# EAGLE design PSPS_AVNC_SRD_CS_combined-2021-02-07 (EAGLE 9.6.2)
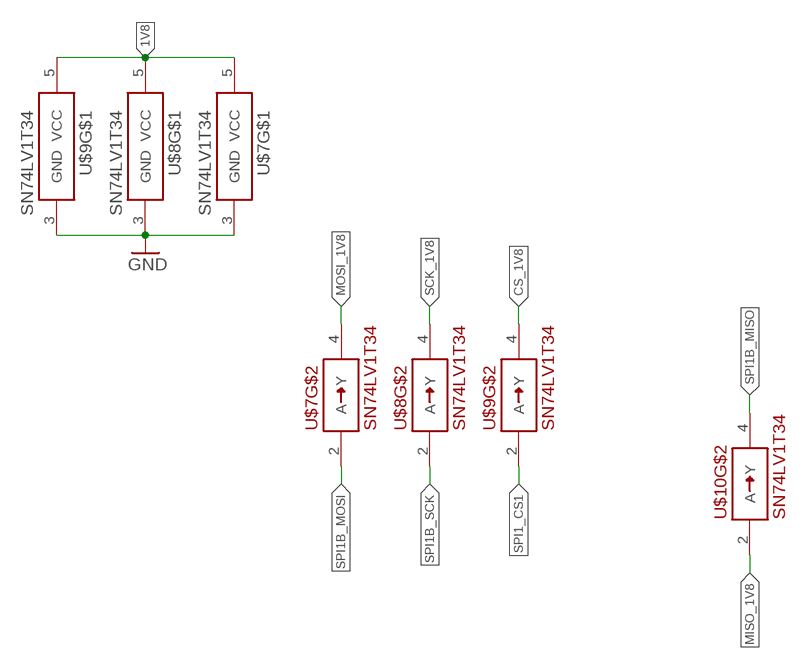
[diagram p0: schematic, sheet 1, part 1 of 2]
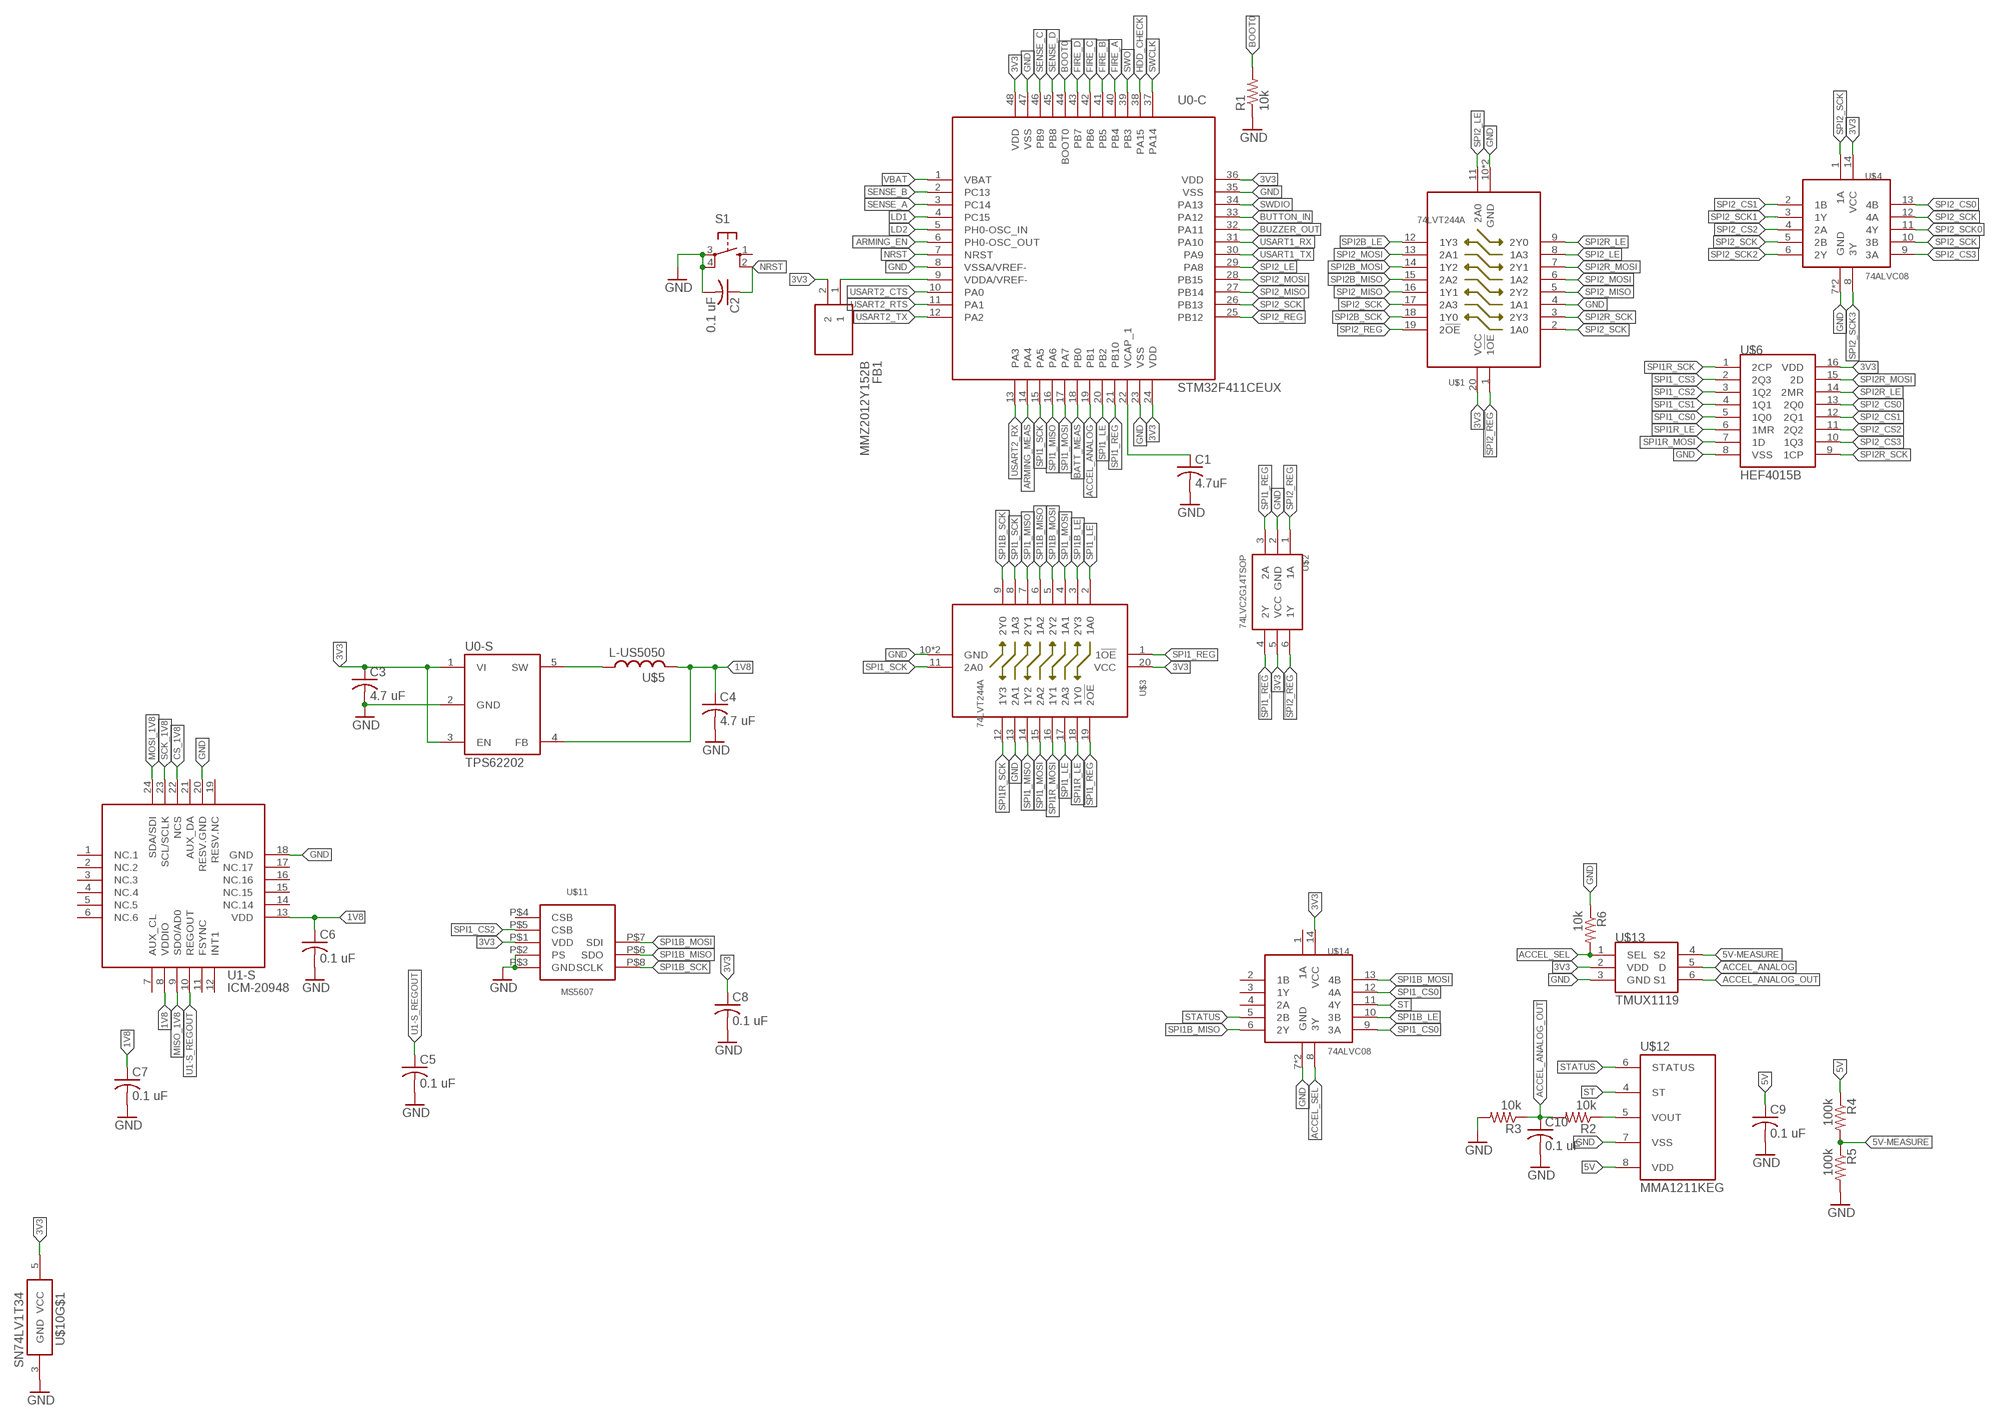
[diagram p1: schematic, sheet 1, part 2 of 2]

## Parts
C1  4.7uF  C-USC0805  [C0805]
C2  0.1 uF  C-USC0805  [C0805]
C3  4.7 uF  C-USC0805  [C0805]
C4  4.7 uF  C-USC0805  [C0805]
C5  0.1 uF  C-USC0805  [C0805]
C6  0.1 uF  C-USC0805  [C0805]
C7  0.1 uF  C-USC0805  [C0805]
C8  0.1 uF  C-USC0805  [C0805]
C9  0.1 uF  C-USC0805  [C0805]
C10  0.1 uF  C-USC0805  [C0805]
FB1  MMZ2012Y152B  [BEADC2012X105N]
R1  10k  R-US_M0805  [M0805]
R2  10k  R-US_M0805  [M0805]
R3  10k  R-US_M0805  [M0805]
R4  100k  R-US_M0805  [M0805]
R5  100k  R-US_M0805  [M0805]
R6  10k  R-US_M0805  [M0805]
S1  10-XX  [B3F-10XX]
U0-C  STM32F411CEUX  [QFN50P700X700X50-49T560N]
U0-S  TPS62202  [SOT95P280X145-5]
U1-S  ICM-20948  [QFN40P300X300X105-25T159X175]
U$1  74LVT244A  [QFN50P450X250X100-21T300X100N]
U$2  74LVC2G14TSOP  [SOP95P280X110-6N]
U$3  74LVT244A  [QFN50P450X250X100-21T300X100N]
U$4  74ALVC08  [QFN50P300X250X100-15T150X100N]
U$5  L-US5050  [INDDFN1250X1250X600-2N]
U$6  HEF4015B  [SOIC127P600X265-16N]
U$7  SN74LV1T34  [SOT65P210X110-5]
U$8  SN74LV1T34  [SOT65P210X110-5]
U$9  SN74LV1T34  [SOT65P210X110-5]
U$10  SN74LV1T34  [SOT65P210X110-5]
U$11  MS5607  [MS5607]
U$12  MMA1211KEG  [SOIC127P1041X355-16N]
U$13  TMUX1119  [SOP95P280X145-6N]
U$14  74ALVC08  [QFN50P300X250X100-15T150X100N]

## Nets
1V8: C4.1 C6.1 C7.1 U0-S.4(FB) U1-S.8(VDDIO) U1-S.13(VDD) U$5.2 U$7.5(VCC) U$8.5(VCC) U$9.5(VCC)
3V3: C3.1 C8.1 FB1.2 U0-C.24(VDD) U0-C.36(VDD) U0-C.48(VDD) U0-S.1(VI) U0-S.3(EN) U$1.20(VCC) U$2.5(VCC) U$3.20(VCC) U$4.14(VCC) U$6.16(VDD) U$10.5(VCC) U$11.P$1(VDD) U$13.2(VDD) U$14.14(VCC)
5V: C9.1 R4.1 U$12.8(VDD)
5V-MEASURE: R4.2 R5.1 U$13.4(S2)
!SPI1_REG!: U$2.4(2Y) U$3.19(2!OE!)
!SPI2_REG!: U$1.1(1!OE!) U$2.6(1Y)
ACCEL_ANALOG: U0-C.19(PB1) U$13.5(D)
ACCEL_ANALOG_OUT: C10.1 R2.2 R3.1 U$13.6(S1)
ACCEL_SEL: R6.2 U$13.1(SEL) U$14.8(3Y)
ARMING_EN: U0-C.6(PH0-OSC_OUT)
ARMING_MEAS: U0-C.14(PA4)
BATT_MEAS: U0-C.18(PB0)
BOOT0: R1.2 U0-C.44(BOOT0)
BUTTON_IN: U0-C.33(PA12)
BUZZER_OUT: U0-C.32(PA11)
CS_1V8: U1-S.22(NCS) U$9.4(Y)
FIRE_A: U0-C.40(PB4)
FIRE_B: U0-C.41(PB5)
FIRE_C: U0-C.42(PB6)
FIRE_D: U0-C.43(PB7)
GND: C1.2 C2.2 C3.2 C4.2 C5.2 C6.2 C7.2 C8.2 C9.2 C10.2 R1.1 R3.2 R5.2 R6.1 S1.3(P) S1.4(P1) U0-C.8(VSSA/VREF-) U0-C.23(VSS) U0-C.35(VSS) U0-C.47(VSS) U0-S.2(GND) U1-S.18(GND) U1-S.20(RESV.GND) U$1.4(1A1) U$1.10(GND) U$1.21(GND) U$2.2(GND) U$3.10(GND) U$3.13(2A1) U$3.21(GND) U$4.7(GND) U$4.15(GND) U$6.8(VSS) U$7.3(GND) U$8.3(GND) U$9.3(GND) U$10.3(GND) U$11.P$2(PS) U$11.P$3(GND) U$12.7(VSS) U$13.3(GND) U$14.7(GND) U$14.15(GND)
HDD_CHECK: U0-C.38(PA15)
LD1: U0-C.4(PC15)
LD2: U0-C.5(PH0-OSC_IN)
MISO_1V8: U1-S.9(SDO/AD0) U$10.2(A)
MOSI_1V8: U1-S.24(SDA/SDI) U$7.4(Y)
NRST: C2.1 S1.2(S1) U0-C.7(NRST)
SCK_1V8: U1-S.23(SCL/SCLK) U$8.4(Y)
SENSE_A: U0-C.3(PC14)
SENSE_B: U0-C.2(PC13)
SENSE_C: U0-C.46(PB9)
SENSE_D: U0-C.45(PB8)
SPI1_CS0: U$6.5(1Q0) U$14.9(3A) U$14.12(4A)
SPI1_CS1: U$6.4(1Q1) U$9.2(A)
SPI1_CS2: U$6.3(1Q2) U$11.P$5(CSB)
SPI1_CS3: U$6.2(2Q3)
SPI1_LE: U0-C.20(PB2) U$3.2(1A0) U$3.17(2A3)
SPI1_MISO: U0-C.16(PA6) U$3.7(2Y1) U$3.14(1Y2)
SPI1_MOSI: U0-C.17(PA7) U$3.4(1A1) U$3.15(2A2)
SPI1_REG: U0-C.21(PB10) U$2.3(2A) U$3.1(1!OE!)
SPI1_SCK: U0-C.15(PA5) U$3.8(1A3) U$3.11(2A0)
SPI1B_LE: U$3.3(2Y3) U$14.10(3B)
SPI1B_MISO: U$3.6(1A2) U$10.4(Y) U$11.P$6(SDO) U$14.6(2Y)
SPI1B_MOSI: U$3.5(2Y2) U$7.2(A) U$11.P$7(SDI) U$14.13(4B)
SPI1B_SCK: U$3.9(2Y0) U$8.2(A) U$11.P$8(SCLK)
SPI1R_LE: U$3.18(1Y0) U$6.6(1MR)
SPI1R_MOSI: U$3.16(1Y1) U$6.7(1D)
SPI1R_SCK: U$3.12(1Y3) U$6.1(2CP)
SPI2_CS0: U$4.13(4B) U$6.13(2Q0)
SPI2_CS1: U$4.2(1B) U$6.12(2Q1)
SPI2_CS2: U$4.4(2A) U$6.11(2Q2)
SPI2_CS3: U$4.9(3A) U$6.10(1Q3)
SPI2_LE: U0-C.29(PA8) U$1.8(1A3) U$1.11(2A0)
SPI2_MISO: U0-C.27(PB14) U$1.5(2Y2) U$1.16(1Y1)
SPI2_MOSI: U0-C.28(PB15) U$1.6(1A2) U$1.13(2A1)
SPI2_REG: U0-C.25(PB12) U$1.19(2!OE!) U$2.1(1A)
SPI2_SCK: U0-C.26(PB13) U$1.2(1A0) U$1.17(2A3) U$4.1(1A) U$4.5(2B) U$4.10(3B) U$4.12(4A)
SPI2_SCK0: U$4.11(4Y)
SPI2_SCK1: U$4.3(1Y)
SPI2_SCK2: U$4.6(2Y)
SPI2_SCK3: U$4.8(3Y)
SPI2B_LE: U$1.12(1Y3)
SPI2B_MISO: U$1.15(2A2)
SPI2B_MOSI: U$1.14(1Y2)
SPI2B_SCK: U$1.18(1Y0)
SPI2R_LE: U$1.9(2Y0) U$6.14(2MR)
SPI2R_MOSI: U$1.7(2Y1) U$6.15(2D)
SPI2R_SCK: U$1.3(2Y3) U$6.9(1CP)
ST: U$12.4(ST) U$14.11(4Y)
STATUS: U$12.6(STATUS) U$14.5(2B)
SWCLK: U0-C.37(PA14)
SWDIO: U0-C.34(PA13)
SWO: U0-C.39(PB3)
U0-S_SW: U0-S.5(SW) U$5.1
U0-S_VOUT: R2.1 U$12.5(VOUT)
U1-S_REGOUT: C5.1 U1-S.10(REGOUT)
USART1_RX: U0-C.31(PA10)
USART1_TX: U0-C.30(PA9)
USART2_CTS: U0-C.10(PA0)
USART2_RTS: U0-C.11(PA1)
USART2_RX: U0-C.13(PA3)
USART2_TX: U0-C.12(PA2)
VBAT: U0-C.1(VBAT)
VCAP_1: C1.1 U0-C.22(VCAP_1)
VDDA: FB1.1 U0-C.9(VDDA/VREF-)
Unconnected: S1.1(S) U1-S.1(NC.1) U1-S.2(NC.2) U1-S.3(NC.3) U1-S.4(NC.4) U1-S.5(NC.5) U1-S.6(NC.6) U1-S.7(AUX_CL) U1-S.11(FSYNC) U1-S.12(INT1) U1-S.14(NC.14) U1-S.15(NC.15) U1-S.16(NC.16) U1-S.17(NC.17) U1-S.19(RESV.NC) U1-S.21(AUX_DA) U$11.P$4(CSB) U$14.1(1A) U$14.2(1B) U$14.3(1Y) U$14.4(2A)

## Library data of the parts
C1-C10 = resistor:C-US: CAPACITOR, American symbol
FB1 = Computer2:MMZ2012Y152B: Ferrite bead SMD 1500Ohm 500mA TDK Ferrite Bead (Chip Bead), 2 x 1.25 x 0.85mm (0805) Source: Datasheet <https://componentsearchengine.com/Datasheets/1/MMZ2012Y152B.pdf>; DESCRIPTION: Ferrite bead SMD 1500Ohm 500mA TDK Ferrite Bead (Chip Bead), 2 x 1.25 x 0.85mm (0805); HEIGHT: 1.05mm; MANUFACTURER_NAME: TDK; MANUFACTURER_PART_NUMBER: MMZ2012Y152B; MOUSER_PART_NUMBER: 810-MMZ2012Y152B; MOUSER_PRICE-STOCK: https://www.mouser.com/Search/Refine.aspx?Keyword=810-MMZ2012Y152B
R1-R6 = resistor:R-US_: RESISTOR, American symbol
S1 = switch-omron:10-XX: OMRON SWITCH; MPN: B3F-1000; OC_FARNELL: 176432; OC_NEWARK: 36M3542
U0-C = Computer2:STM32F411CEUX: STM32F411CEUx https://www.mouser.com/ProductDetail/STMicroelectronics/STM32F411CEU7/?qs=k5OWtXsTJaprF2FuhgNRlw%3D%3D
U0-S = Computer2:TPS62202: 1.8-V Output, 300-mA, 95% Efficient Step-Down Converter in SOT-23 http://www.ti.com/product/TPS62202
U1-S = Computer2:ICM-20948: 9 Axis Motion Sensor from TDK InvenSense https://store.invensense.com/products/detail/ICM20948-InvenSense/597203/
U$1 U$3 = Computer2:74LVT244A: 3.3 V octal buffer/line driver; 3-state (split) https://www.mouser.com/ProductDetail/Nexperia/74LVT244ABQ115/?qs=me8TqzrmIYX0op6H%252BBs37A%3D%3D
U$2 = Computer2:74LVC2G14: Dual inverting Schmitt trigger with 5 V tolerant input https://www.mouser.com/ProductDetail/Nexperia/74LVC2G14GF132/?qs=me8TqzrmIYXgua1MCaM%2FQg%3D%3D
U$4 U$14 = Computer2:74ALVC08: Quad 2-input AND Gate
U$5 = Computer2:L-US
U$6 = Computer2:HEF4015B
U$7-U$10 = Computer2:SN74LV1T34: Single Power Supply BUFFER Logic Level Shifter
U$11 = Computer2:MS5607
U$12 = Computer2:MMA1211KEG
U$13 = Computer2:TMUX1119: Analog Switch IC (Multiplexer) https://www.mouser.com/ProductDetail/Texas-Instruments/TMUX1119DBVR/?qs=9r4v7xj2Lnn%2FqYCDWCSZ7w%3D%3D

## Board
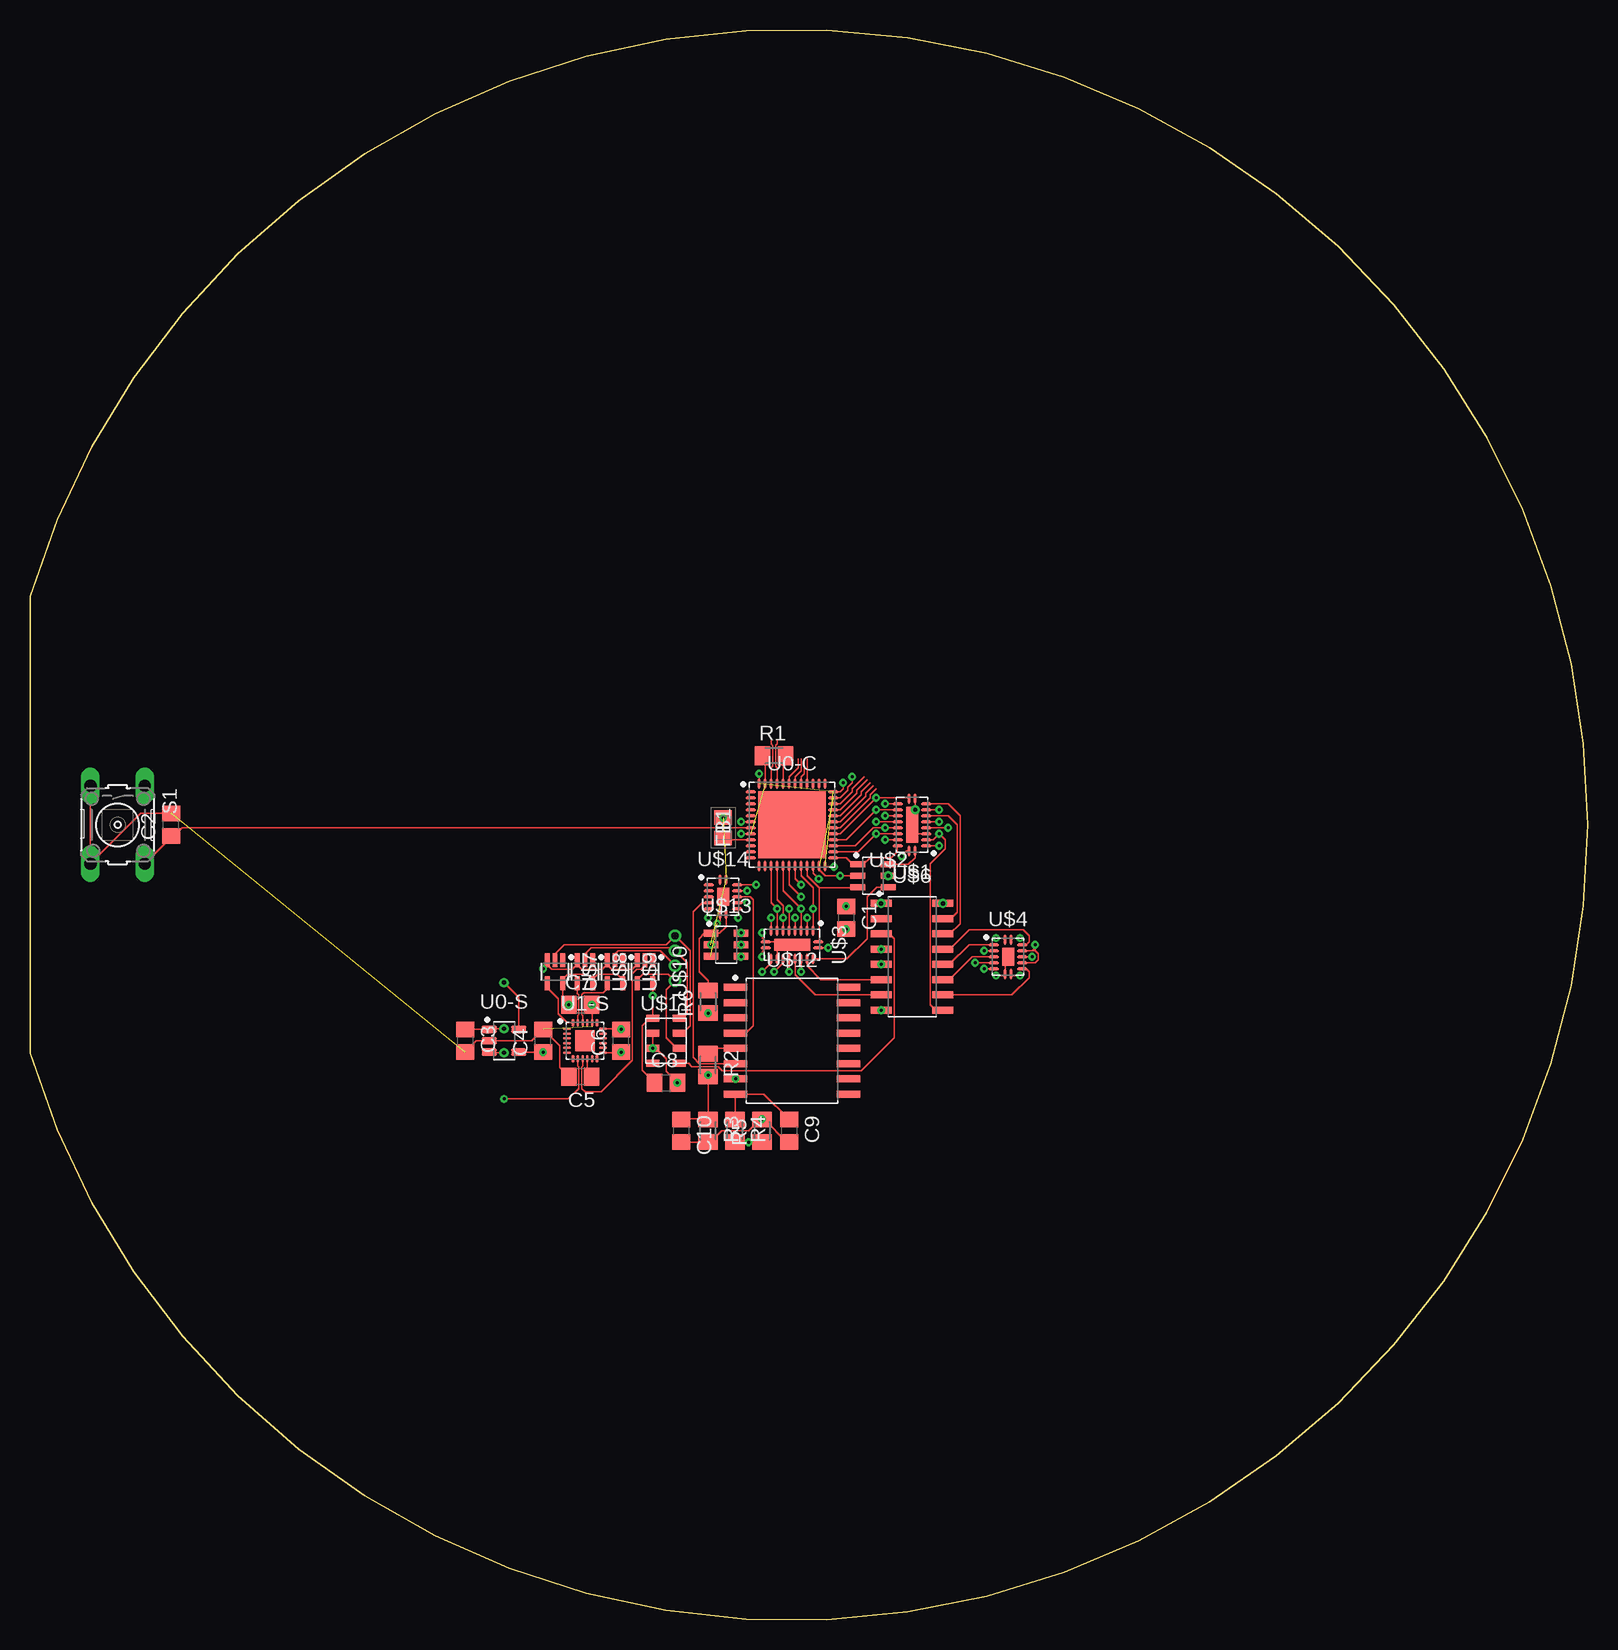
[diagram p2: board, top side]
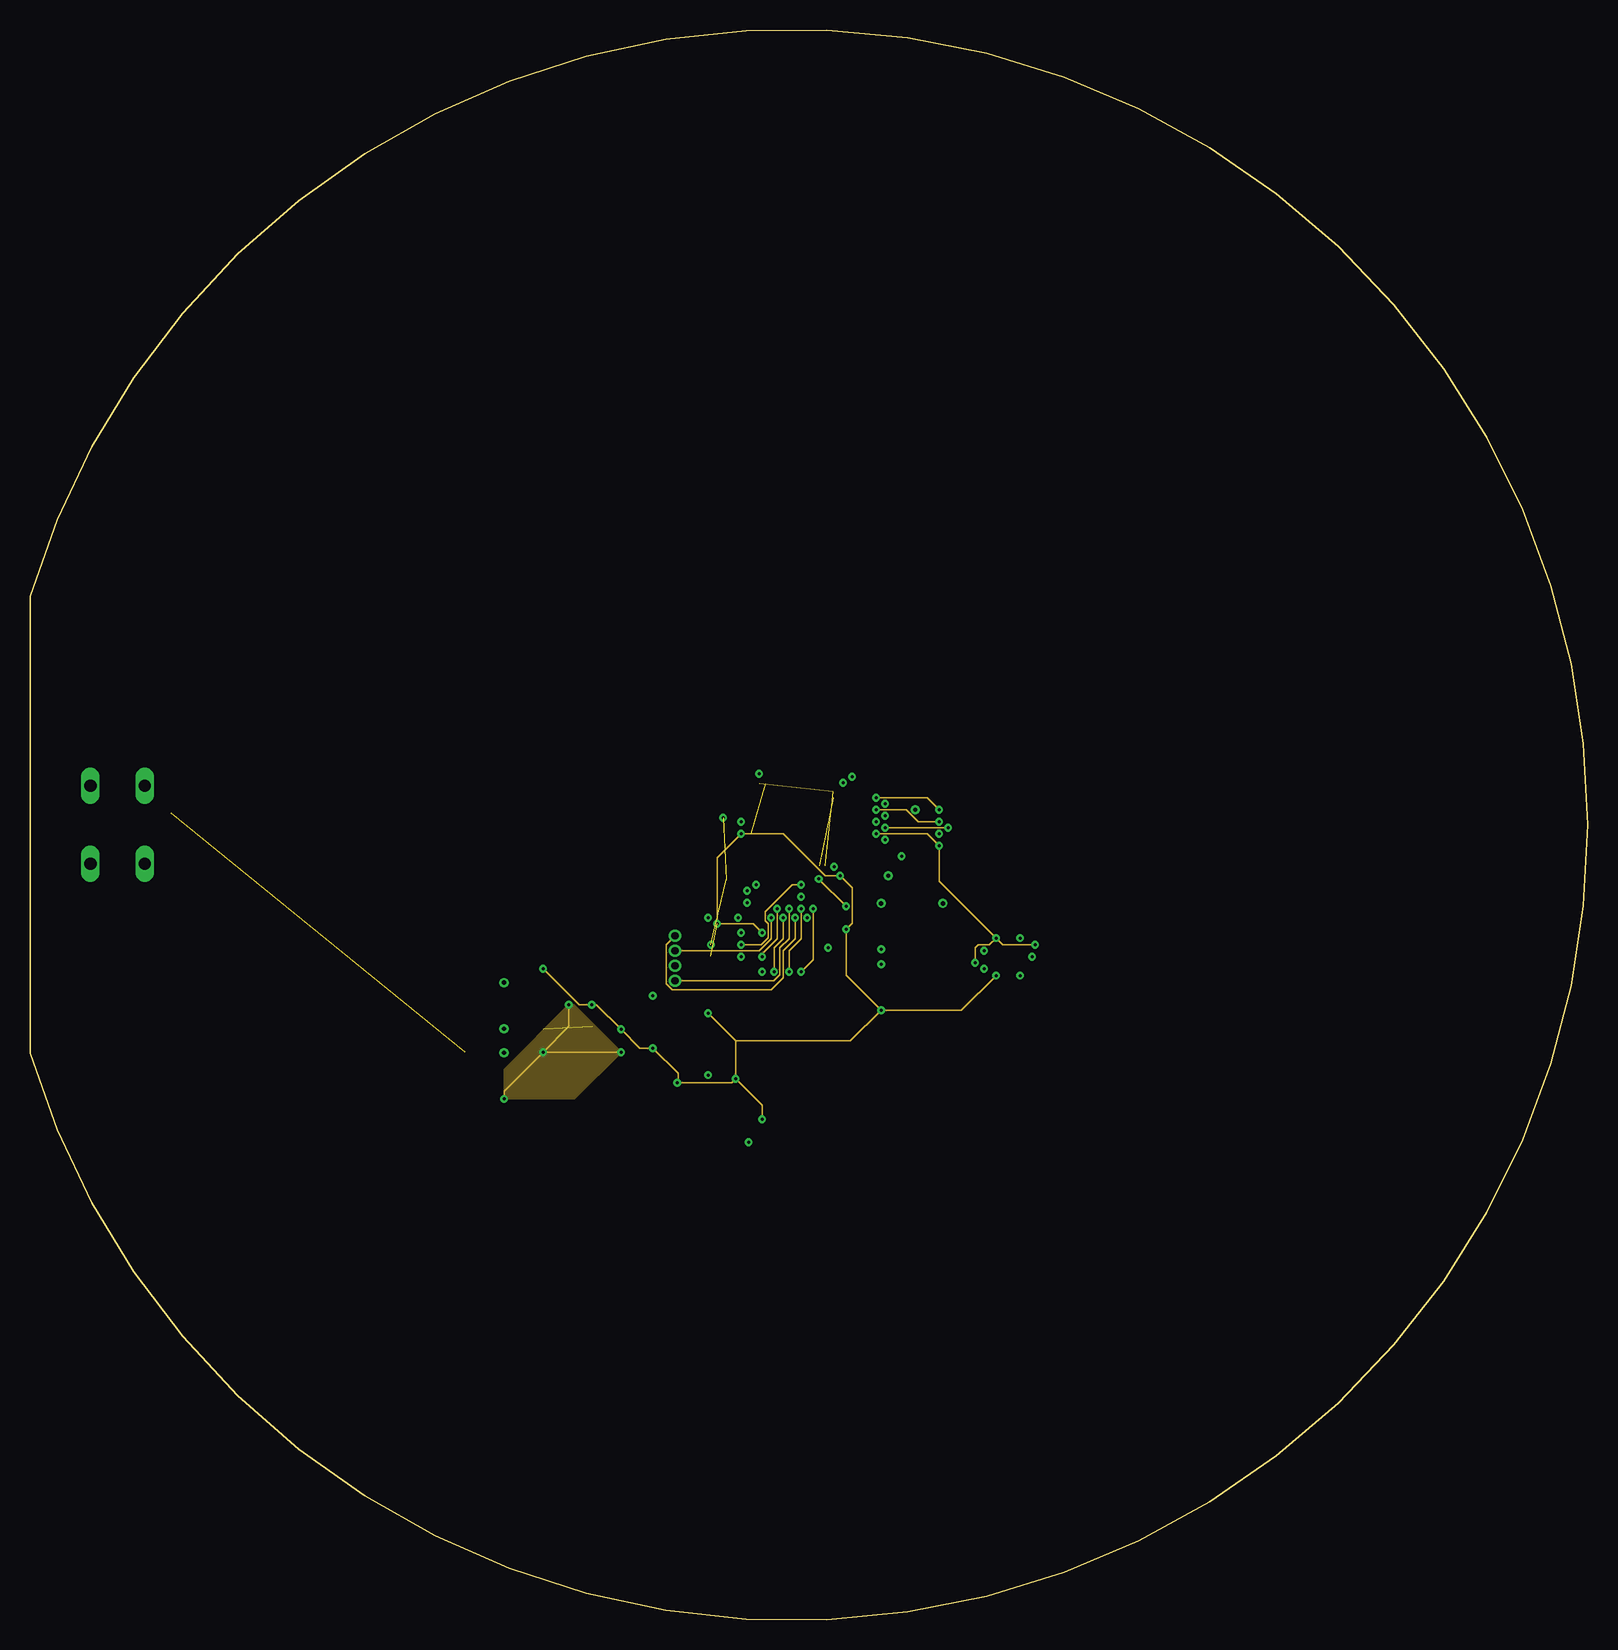
[diagram p3: board, inner layer Route2]
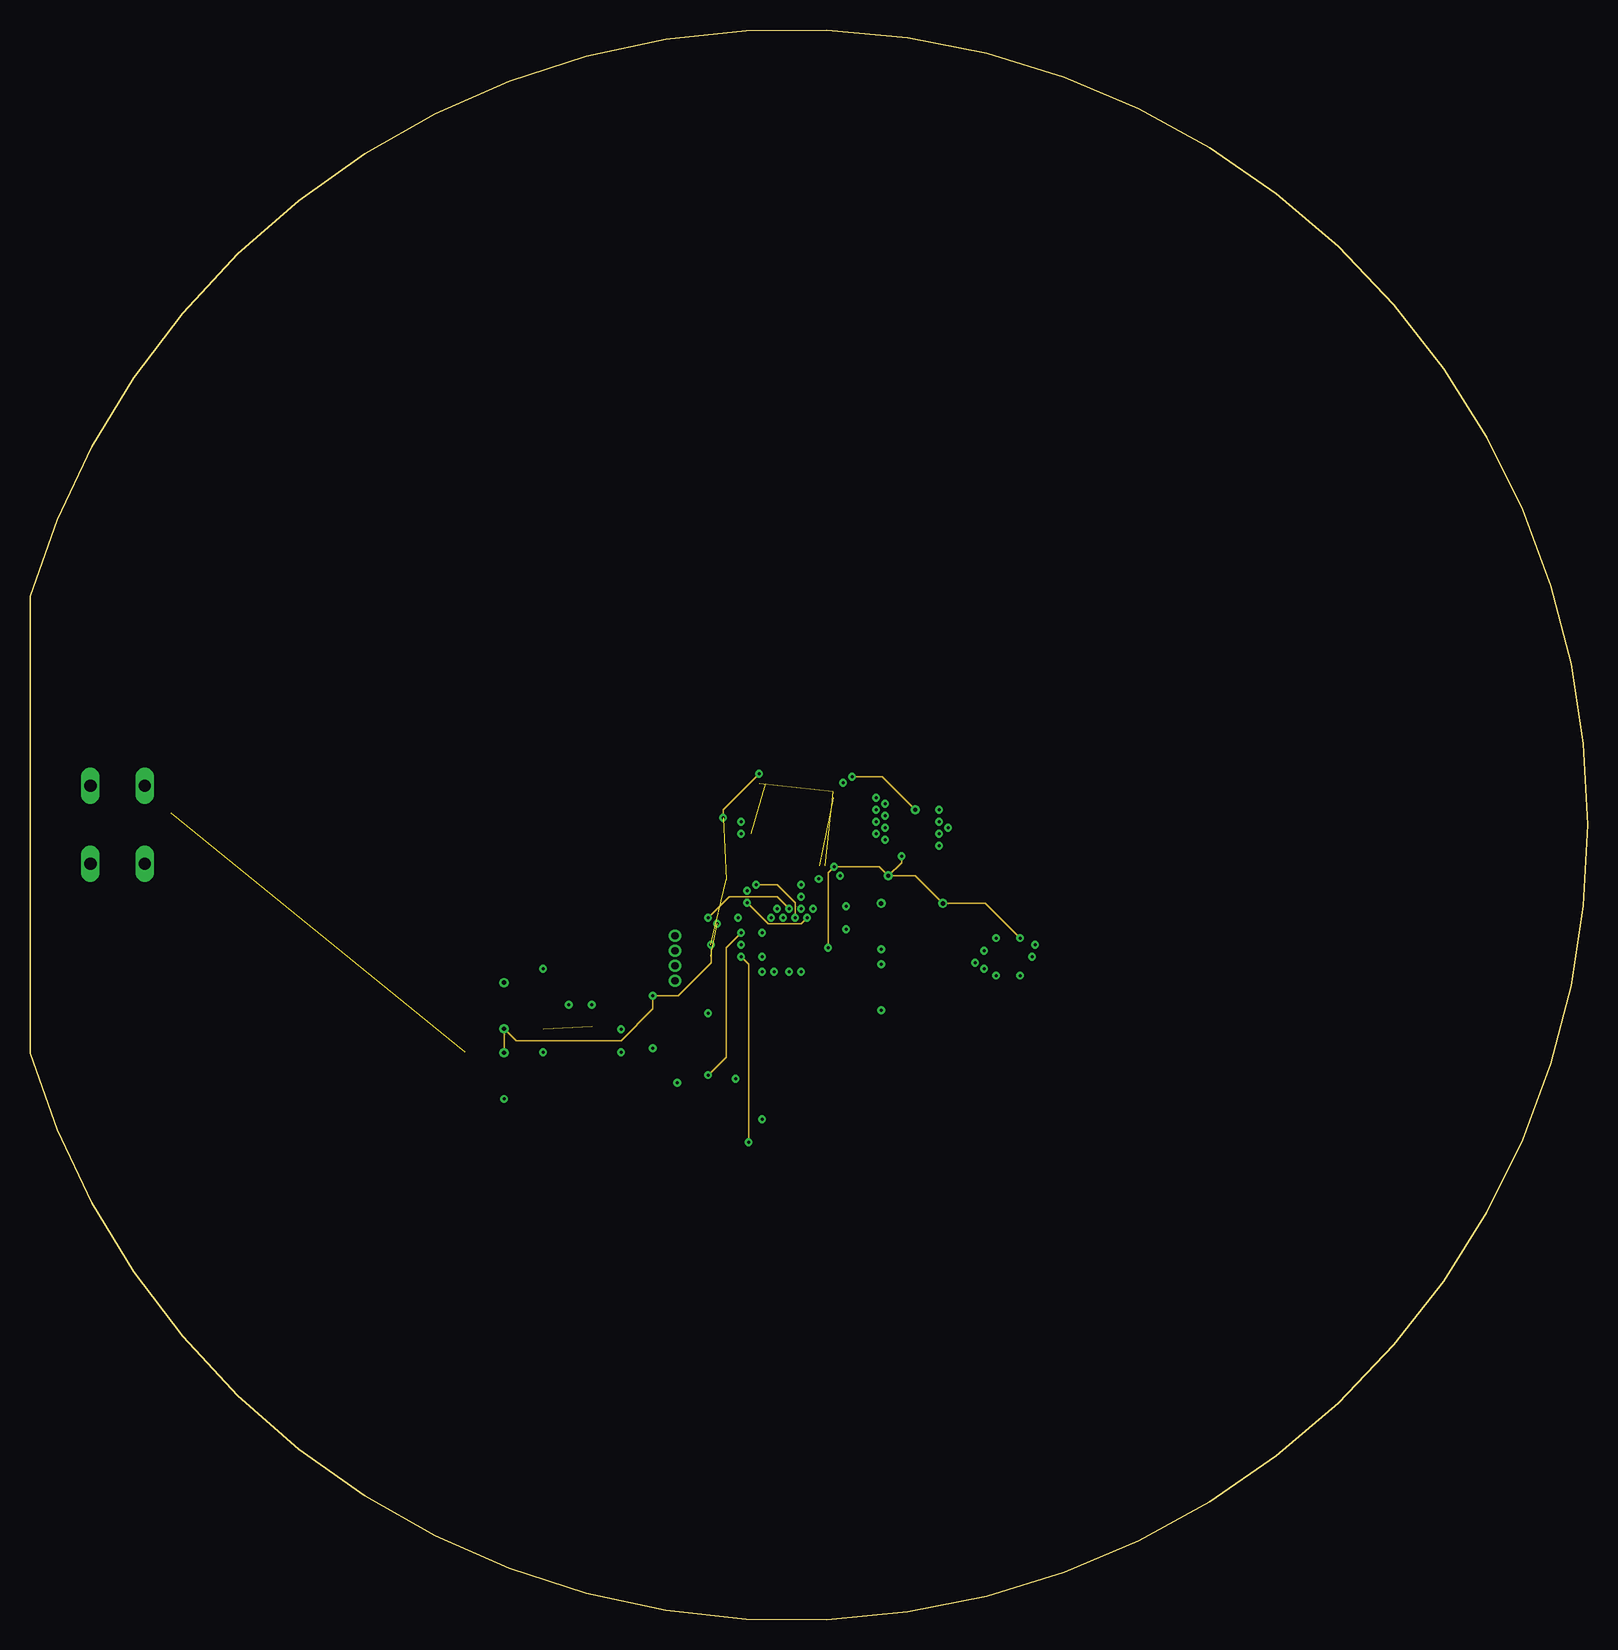
[diagram p4: board, inner layer Route15]
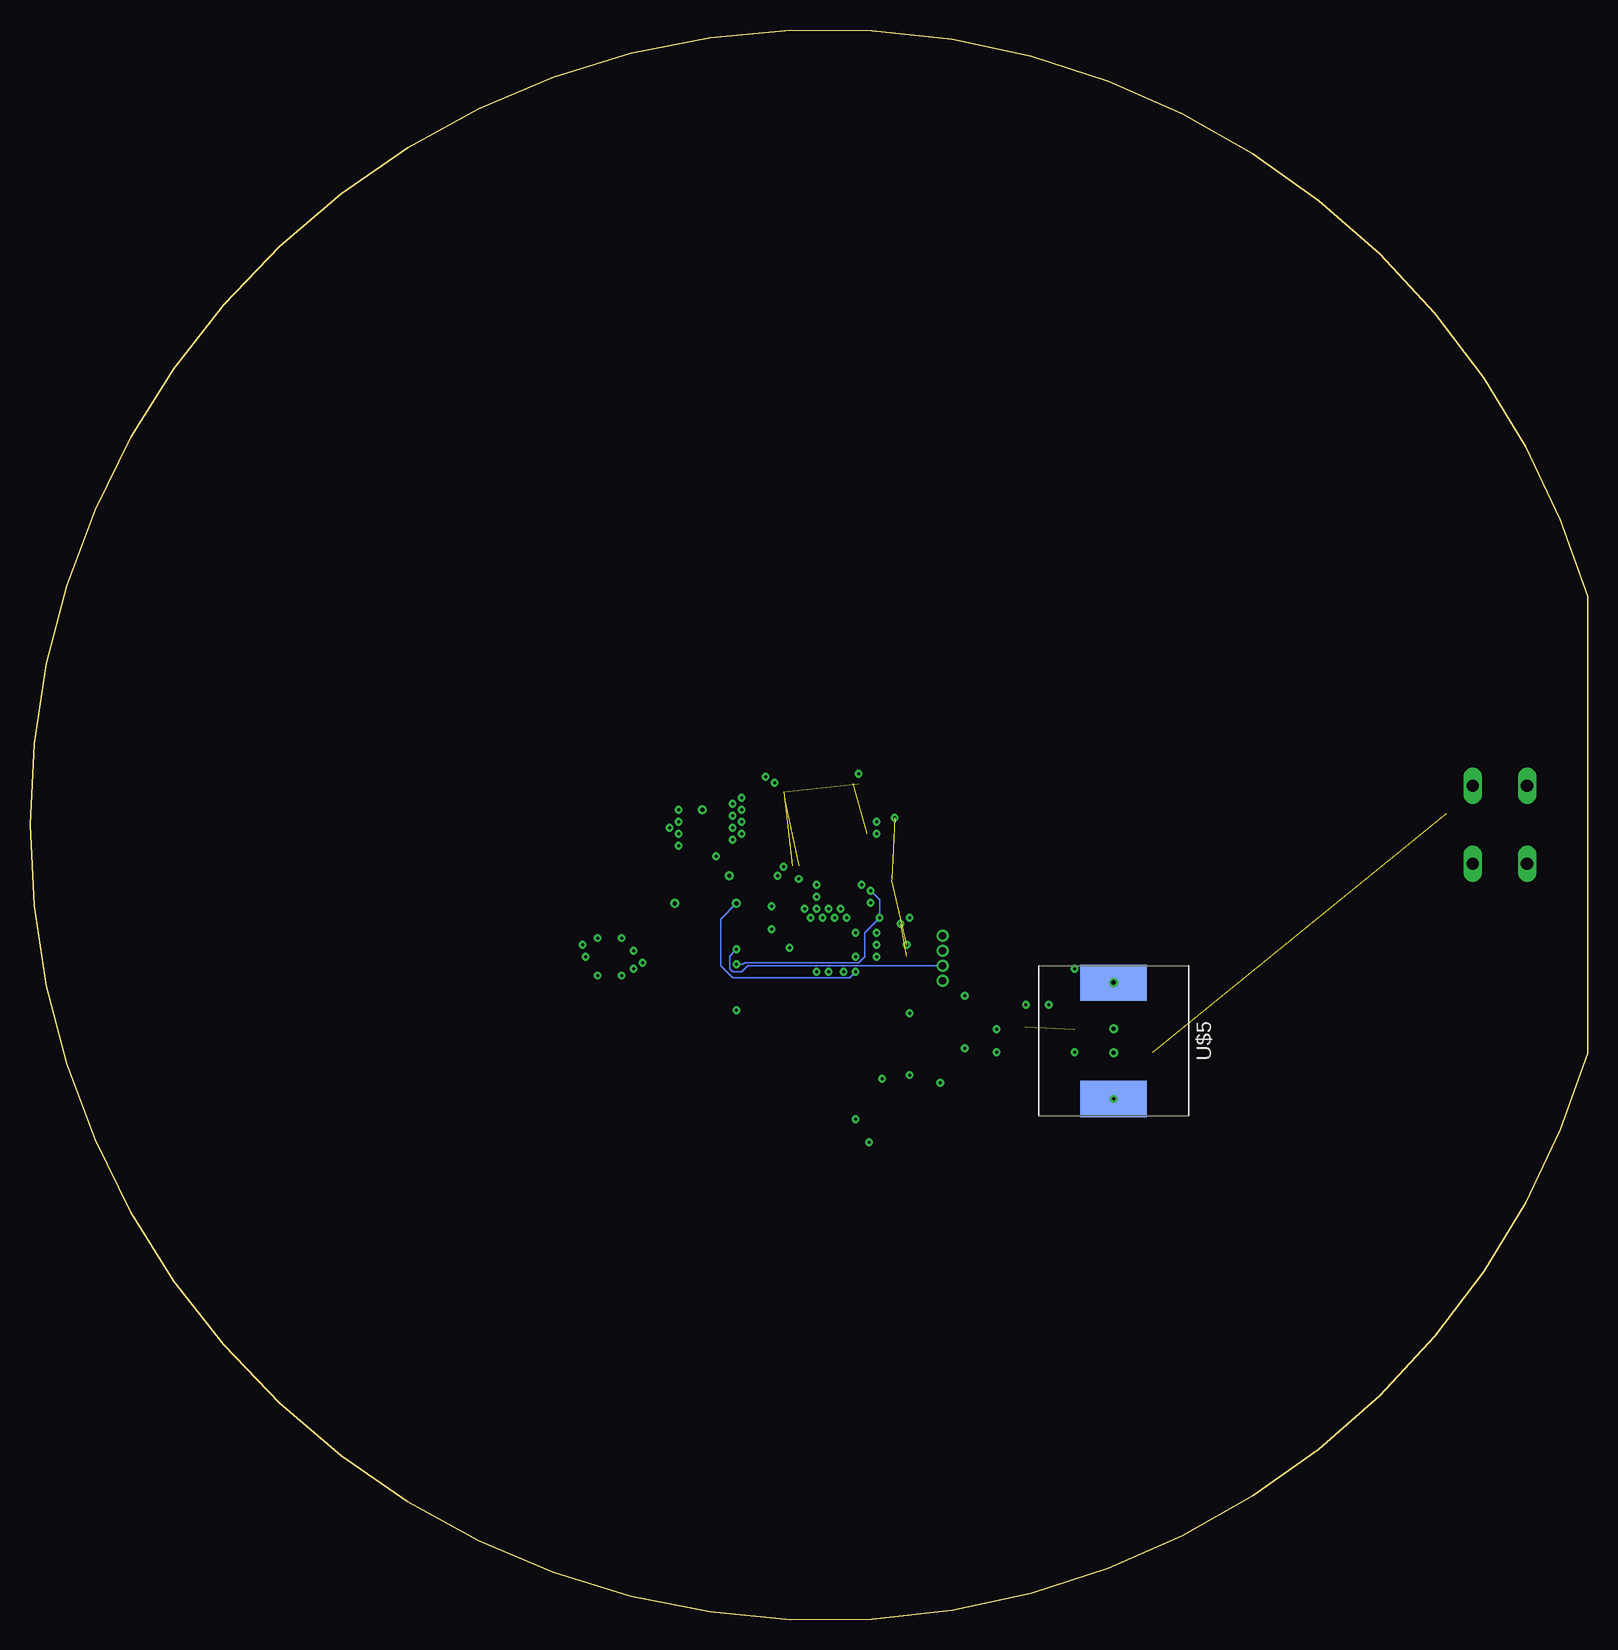
[diagram p5: board, bottom side, seen from below]

Size 129.8 x 132.46 mm. Coordinates in mm from the lower left corner, seen from the top.
Outline: 0,47.18 0,85.28 arc-327 0,47.18
Copper layers (1+2*15+16): Top 0.035mm / dielectric 1.5mm / Route2 0.035mm / dielectric 0.15mm / Route15 0.035mm / dielectric 0.2mm / Bottom 0.035mm
Design rules "default *": minimum track width 4mil, minimum drill 0.25mm, track to track 4mil, track to pad 4mil, pad to pad 4mil, via to via 4mil, smd to smd 4mil, copper to edge 20mil, drill to drill 4mil, minimum pad ring 10mil, minimum via ring 8mil, stop-mask expansion 4mil, vias tented up to drill 0mil, thermal gap 10mil

### Footprints (pad centres in the part's own frame; a part is rotated, then mirrored left to right if it is on the bottom)
C0805 = smd 1.3 x 1.5: 1 -0.95,0; 2 0.95,0
BEADC2012X105N = smd 1.2 x 1.45: 1 -0.85,0; 2 0.85,0
M0805 = smd 1.3 x 1.6: 1 -0.95,0; 2 0.95,0
B3F-10XX = drill 1.016 long: 1 -3.251,2.261; 2 3.251,2.261; 3 -3.251,-2.261; 4 3.251,-2.261
QFN50P700X700X50-49T560N = smd 0.86 x 0.27: 1 -3.435,2.75; 2 -3.435,2.25; 3 -3.435,1.75; 4 -3.435,1.25; 5 -3.435,0.75; 6 -3.435,0.25; 7 -3.435,-0.25; 8 -3.435,-0.75; 9 -3.435,-1.25; 10 -3.435,-1.75; 11 -3.435,-2.25; 12 -3.435,-2.75; 25 3.435,-2.75; 26 3.435,-2.25; 27 3.435,-1.75; 28 3.435,-1.25; 29 3.435,-0.75; 30 3.435,-0.25; 31 3.435,0.25; 32 3.435,0.75; 33 3.435,1.25; 34 3.435,1.75; 35 3.435,2.25; 36 3.435,2.75 | smd 0.27 x 0.86: 13 -2.75,-3.435; 14 -2.25,-3.435; 15 -1.75,-3.435; 16 -1.25,-3.435; 17 -0.75,-3.435; 18 -0.25,-3.435; 19 0.25,-3.435; 20 0.75,-3.435; 21 1.25,-3.435; 22 1.75,-3.435; 23 2.25,-3.435; 24 2.75,-3.435; 37 2.75,3.435; 38 2.25,3.435; 39 1.75,3.435; 40 1.25,3.435; 41 0.75,3.435; 42 0.25,3.435; 43 -0.25,3.435; 44 -0.75,3.435; 45 -1.25,3.435; 46 -1.75,3.435; 47 -2.25,3.435; 48 -2.75,3.435 | smd 5.6 x 5.6: 49 0,0
SOT95P280X145-5 = smd 1.259 x 0.609: 1 -1.228,0.95; 2 -1.228,0; 3 -1.228,-0.95; 4 1.228,-0.95; 5 1.228,0.95
QFN40P300X300X105-25T159X175 = smd 0.635 x 0.203: 1 -1.496,1; 2 -1.496,0.6; 3 -1.496,0.2; 4 -1.496,-0.2; 5 -1.496,-0.6; 6 -1.496,-1; 13 1.496,-1; 14 1.496,-0.6; 15 1.496,-0.2; 16 1.496,0.2; 17 1.496,0.6; 18 1.496,1 | smd 0.203 x 0.635: 7 -1,-1.496; 8 -0.6,-1.496; 9 -0.2,-1.496; 10 0.2,-1.496; 11 0.6,-1.496; 12 1,-1.496; 19 1,1.496; 20 0.6,1.496; 21 0.2,1.496; 22 -0.2,1.496; 23 -0.6,1.496; 24 -1,1.496 | smd 1.59 x 1.75: 25 0,0
QFN50P450X250X100-21T300X100N = smd 0.27 x 0.86: 1 -0.25,2.185; 10 -0.25,-2.185; 11 0.25,-2.185; 20 0.25,2.185 | smd 0.86 x 0.27: 2 -1.185,1.75; 3 -1.185,1.25; 4 -1.185,0.75; 5 -1.185,0.25; 6 -1.185,-0.25; 7 -1.185,-0.75; 8 -1.185,-1.25; 9 -1.185,-1.75; 12 1.185,-1.75; 13 1.185,-1.25; 14 1.185,-0.75; 15 1.185,-0.25; 16 1.185,0.25; 17 1.185,0.75; 18 1.185,1.25; 19 1.185,1.75 | smd 1 x 3: 21 0,0
SOP95P280X110-6N = smd 1.265 x 0.497: 1 -1.273,0.95; 2 -1.273,0; 3 -1.273,-0.95; 4 1.273,-0.95; 5 1.273,0; 6 1.273,0.95
QFN50P300X250X100-15T150X100N = smd 0.27 x 0.86: 1 -0.25,1.435; 7 -0.25,-1.435; 8 0.25,-1.435; 14 0.25,1.435 | smd 0.86 x 0.27: 2 -1.185,1; 3 -1.185,0.5; 4 -1.185,0; 5 -1.185,-0.5; 6 -1.185,-1; 9 1.185,-1; 10 1.185,-0.5; 11 1.185,0; 12 1.185,0.5; 13 1.185,1 | smd 1 x 1.5: 15 0,0
INDDFN1250X1250X600-2N = smd 3.012 x 5.512: 1 -4.85,0; 2 4.85,0
SOIC127P600X265-16N = smd 1.765 x 0.592: 1 -2.575,4.445; 2 -2.575,3.175; 3 -2.575,1.905; 4 -2.575,0.635; 5 -2.575,-0.635; 6 -2.575,-1.905; 7 -2.575,-3.175; 8 -2.575,-4.445; 9 2.575,-4.445; 10 2.575,-3.175; 11 2.575,-1.905; 12 2.575,-0.635; 13 2.575,0.635; 14 2.575,1.905; 15 2.575,3.175; 16 2.575,4.445
SOT65P210X110-5 = smd 1.186 x 0.397: 1 -0.962,0.65; 2 -0.962,0; 3 -0.962,-0.65; 4 0.962,-0.65; 5 0.962,0.65
MS5607 = smd 1.1 x 0.6: P$1 -1.1,1.875; P$2 -1.1,0.625; P$3 -1.1,-0.625; P$4 -1.1,-1.875; P$5 1.1,-1.875; P$6 1.1,-0.625; P$7 1.1,0.625; P$8 1.1,1.875
SOIC127P1041X355-16N = smd 1.973 x 0.589: 1 -4.705,4.445; 2 -4.705,3.175; 3 -4.705,1.905; 4 -4.705,0.635; 5 -4.705,-0.635; 6 -4.705,-1.905; 7 -4.705,-3.175; 8 -4.705,-4.445; 9 4.705,-4.445; 10 4.705,-3.175; 11 4.705,-1.905; 12 4.705,-0.635; 13 4.705,0.635; 14 4.705,1.905; 15 4.705,3.175; 16 4.705,4.445
SOP95P280X145-6N = smd 1.209 x 0.584: 1 -1.253,0.95; 2 -1.253,0; 3 -1.253,-0.95; 4 1.253,-0.95; 5 1.253,0; 6 1.253,0.95

### Placement (x,y rotation side)
C1  68,58.48 270 top
C2  11.75,66.23 90 top
C3  36.25,48.23 270 top
C4  42.75,48.23 90 top
C5  45.85,45.23 180 top
C6  49.25,48.23 90 top
C7  45.85,51.23 0 top
C8  53,44.73 0 top
C9  63.25,40.73 270 top
C10  54.25,40.73 270 top
FB1  57.75,65.98 90 top
R1  62,71.98 0 top
R2  56.5,46.2 270 top
R3  56.5,40.73 270 top
R4  58.75,40.73 270 top
R5  61,40.73 90 top
R6  56.5,51.48 90 top
S1  7.3,66.23 270 top
U0-C  63.5,66.23 0 top
U0-S  39.5,48.23 0 top
U1-S  46.25,48.23 0 top
U$1  73.5,66.23 180 top
U$2  70.25,61.98 0 top
U$3  63.5,56.23 270 top
U$4  81.5,55.23 0 top
U$5  39.5,48.23 270 bottom
U$6  73.5,55.23 0 top
U$7  43.75,53.98 270 top
U$8  46.25,53.98 270 top
U$9  48.75,53.98 270 top
U$10  51.25,53.98 270 top
U$11  53,48.23 0 top
U$12  63.5,48.23 0 top
U$13  58,56.23 0 top
U$14  57.75,60.23 0 top

### Tracks (layer width: path | path; a pad name or v marks a point on that pad's centre or on a via)
1V8  (via drill 0.25)
  Top 0.127: U0-S.4 C4.1 | U1-S.8 45.65,46.11 45.72,46.05 45.72,44.25 44.85,43.38 U$5.2 | C6.1 49.2,47.23 U1-S.13 | U$9.5 49.4,53.33 48.95,53.78 47.3,53.78 46.9,53.38 U$8.5 46.9,53.33 46.45,53.78 44.8,53.78 44.4,53.38 U$7.5 44.4,51.73 C7.1
  Route2 0.127: C4.1 C6.1 | C7.1 44.9,49.43 C4.1 | U$5.2 39.5,44.03 C4.1
  other vias: 44.9,51.23 44.9,51.23 42.75,47.28 39.5,43.38 49.25,47.28
  pour Route2 (no thermals): 39.5,43.38 39.5,45.83 44.9,51.23 45.3,51.23 49.25,47.28 45.35,43.38
3V3  (via drill 0.25, 0.35)  (4 unrouted)
  Top 0.127: U0-C.24 66.31,62.73 v67,62.73 | U$1.20 73.06,64.05 v72.62,63.61 | U$3.20 v66.5,55.98 | U0-C.36 67.5,68.98 67.75,69.23 v67.75,69.73 | C3.1 U0-S.1 38.32,49.23 v39.5,49.23 | U0-S.3 38.32,47.23 v39.5,47.23 | U$4.14 81.88,56.8 v82.5,56.8 | U$10.5 v51.9,51.98 U$11.P$1 51.62,50.11 51,49.48 51,45.78 C8.1 | U0-C.48 v60.75,70.48
  Route15 0.127: U$2.5 70.77,62.73 v67,62.73 66.5,62.23 v66.5,55.98 | U$2.5 72.62,63.08 v72.62,63.61 | U$2.5 73.77,61.98 U$6.16 79.62,59.68 v82.5,56.8 | v39.5,47.23 v39.5,49.23 40.5,48.23 49.25,48.23 51.9,50.88 v51.9,51.98 54,51.98 56.75,54.73 U$13.2 | FB1.2 57.75,67.48 v60.75,70.48
  other vias: 71.52,61.98 76.08,59.68 57.75,66.83 56.75,56.23
5V
  Top 0.127: R4.1 58.75,43.74 U$12.8 61.15,43.79 C9.1
5V-MEASURE  (via drill 0.25)
  Top 0.127: R5.1 v59.88,39.78 R4.2 | U$13.4 v59.25,55.24
  Route15 0.127: v59.25,55.24 59.88,54.62 v59.88,39.78
!SPI1_REG!
  Top 0.127: U$3.19 66.25,55.05 66.31,55.05 68.06,55.05 69.75,56.73 69.75,60.23 70.55,61.03 U$2.4
!SPI2_REG!
  Top 0.127: U$1.1 73.75,63.48 73.2,62.93 U$2.6
ACCEL_ANALOG  (via drill 0.25)
  Top 0.127: U0-C.19 63.75,61.73 v64.25,61.23
  Route2 0.127: v64.25,61.23 63.5,61.23 61.25,58.98 61.25,58.23 61.5,57.98 61.5,56.8 60.93,56.23 U$13.5
  other vias: 59.25,56.23
ACCEL_ANALOG_OUT  (via drill 0.25)
  Top 0.127: R3.1 56.5,41.73 | 56.5,41.73 R2.2 | C10.1 54.3,41.73 56.5,41.73 | U$13.6 v59.25,57.23
  Route15 0.127: v56.5,45.38 58,46.88 58,55.98 v59.25,57.23
ACCEL_SEL
  Top 0.127: U$14.8 58,57.73 57.45,57.18 U$13.1 56.2,57.18 55.75,56.73 55.75,53.98 56.5,53.23 R6.2
ARMING_EN  (via drill 0.25)
  Top 0.127: U0-C.6 v59.25,66.48
BATT_MEAS  (via drill 0.25)
  Top 0.127: U0-C.18 63.25,61.23 v64.25,60.23
BOOT0
  Top 0.127: U0-C.44 62.75,71.78 R1.2
BUTTON_IN
  Top 0.127: U0-C.33 67.5,67.48 68.88,68.86 68.88,68.98 68.88,69.11 69.75,69.98
BUZZER_OUT
  Top 0.127: U0-C.32 67.5,66.98 69.25,68.73 69.25,68.98 70,69.73
CS_1V8
  Top 0.127: U1-S.22 46.05,50.35 45.98,50.41 45.98,52.05 46.17,52.23 47.75,52.23 48.1,52.58 U$9.4
FIRE_A
  Top 0.127: U0-C.40 64.75,71.73
FIRE_B
  Top 0.127: U0-C.41 64.25,70.23 64.5,70.48 64.5,71.73
FIRE_C
  Top 0.127: U0-C.42 63.75,70.23 64.25,70.73 64.25,71.73
FIRE_D
  Top 0.127: U0-C.43 63.25,70.23 64,70.98 64,71.73
GND  (via drill 0.25, 0.35)  (5 unrouted)
  Top 0.127: U0-C.23 65.75,62.48 66.25,61.98 v67.5,61.98 U$2.2 | U0-C.35 67.5,68.48 68.12,69.11 68.12,69.36 68.5,69.73 v68.5,70.23 | 62.25,56.48 U$3.10 61,56.8 v61,57.23 | 62.25,56.48 63.25,56.48 U$3.21 | 62.25,54.73 U$3.13 62.25,56.48 | U$1.4 73.5,65.48 73.5,65.98 | 73.5,65.98 U$1.21 73.5,67.23 v73.76,67.49 | C3.2 37.2,48.23 U0-S.2 41.8,48.23 C4.2 44.12,47.81 44.12,46.01 C5.2 | U$1.10 73.75,66.23 73.5,65.98 | v80.5,53.67 81.12,53.67 U$4.7 81.25,54.98 U$4.15 | 46.85,49.38 U1-S.20 46.85,51.18 C7.2 | U1-S.18 49.2,49.23 C6.2 | U$10.3 50.6,54.58 50.2,54.18 48.49,54.18 48.1,54.57 U$9.3 48.1,54.58 47.7,54.18 45.99,54.18 45.6,54.57 45.6,54.58 | 45.6,54.58 45.2,54.18 43.49,54.18 43.1,54.57 U$7.3 43.1,54.58 v42.75,54.23 | U$8.3 45.6,54.58 | S1.3 S1.4 | S1.4 | C2.2 9.24,67.18 S1.4 | C8.2 53,45.68 53,46.73 52.12,47.61 U$11.P$3 U$11.P$2 | U0-C.8 v59.25,65.48 | U0-C.47 61.25,71.78 R1.1 | U$14.15 57.5,59.98 U$14.7 57.5,58.23 v57.25,57.98 | C10.2 R3.2 56.67,39.78 57.62,40.73 59.88,40.73 60.83,41.68 R5.2 61.17,41.68 63.08,39.78 C9.2
  Route2 0.127: U$6.8 68,53.71 C1.2 68.5,58.03 68.5,60.98 v67.5,61.98 66.25,61.98 62.75,65.48 v59.25,65.48 57.25,63.48 v57.25,57.98 60.25,57.98 v61,57.23 | v80.5,53.67 77.62,50.79 U$6.8 | v42.75,54.23 45.75,51.23 C7.2 47.2,51.23 C6.2 50.83,47.61 U$11.P$3 54,45.51 54,44.73 | R5.2 61,42.85 U$12.7 | R6.1 58.8,48.24 | 58.8,48.24 U$12.7 | C8.2 54,44.73 | 54,44.73 58.47,44.73 U$12.7 | 58.8,48.24 68.38,48.24 U$6.8
  Route15 0.127: v73.76,67.49 71.02,70.23 v68.5,70.23
  other vias: 49.25,49.18 68,57.53 46.8,51.23 51.9,47.61 58.8,45.06 61,41.68 56.5,50.53 53.95,44.73 53.95,44.73 70.92,50.79
MISO_1V8
  Top 0.127: U1-S.9 46.05,46.11 45.98,46.05 45.98,44.25 46.25,43.98 47.58,43.98 50.2,46.6 50.2,53.83 50.55,54.18 50.95,54.18 51.25,54.48 U$10.2
MOSI_1V8
  Top 0.127: 45.25,49.95 U1-S.24 44.77,49.73 44,50.5 44,51.73 43.1,52.63 U$7.4 43.1,52.52
NRST
  Top 0.127: 11.86,65.28 C2.1 11.75,65.17 | U0-C.7 12.7,65.98 12,65.28 11.86,65.28 | S1.2 11.86,65.28
SCK_1V8
  Top 0.127: 45.65,49.95 U1-S.23 45.65,50.35 45.72,50.41 45.72,52.05 45.6,52.16 U$8.4
SENSE_C
  Top 0.127: U0-C.46 61.75,71 61.91,71.15 61.91,72.83 61.75,72.98 61.75,73.23
SENSE_D
  Top 0.127: U0-C.45 62.25,71 62.13,71.11 62.13,72.87 62.25,72.98 62.25,73.23
SPI1_CS0  (via drill 0.25)
  Top 0.127: U$6.5 71.64,54.6 | U$14.9 59,59.17 v59,58.48 | U$14.12 v59.75,60.73
  Bottom 0.127: v59.75,60.73 59,59.98 v59,58.48 60.25,57.23 60.25,55.23 60.75,54.73 70.25,54.73 70.39,54.6 U$6.5
  other vias: 70.92,54.6
SPI1_CS1  (via drill 0.25, 0.6)
  Top 0.127: U$6.4 71.61,55.87 | 48.75,54.48 U$9.2 48.75,55.48 49,55.73 52.5,55.73 v53.75,54.48
  Bottom 0.127: U$6.4 71.5,55.29 71.5,54.23 71.25,53.98 70.5,53.98 70,54.48 v53.75,54.48
  other vias: 70.92,55.87
SPI1_CS2
  Top 0.127: U$6.3 71.59,57.14 72,56.73 72,48.48 69.25,45.73 57.7,45.73 57.37,46.07 55.16,46.07 54.88,46.36 U$11.P$5
SPI1_CS3
  Top 0.127: U$6.2 71.58,58.41
SPI1_LE  (via drill 0.25)
  Top 0.127: U$3.2 v65.25,59.23 65.25,60.98 64.25,61.98 U0-C.20 | v64.25,53.98 U$3.17
  Route2 0.127: v65.25,59.23 65.25,54.98 v64.25,53.98
SPI1_MISO  (via drill 0.25)
  Top 0.127: U$3.7 v62.75,58.48 62.75,59.48 62.25,59.98 U0-C.16 | U$3.14 62.75,54.73 v62,53.98
  Route2 0.127: v62,53.98 62,55.98 62.75,56.73 v62.75,58.48
SPI1_MOSI  (via drill 0.25)
  Top 0.127: U$3.4 v64.25,59.23 62.75,60.73 U0-C.17 | U$3.15 v63.25,53.98
  Route2 0.127: v63.25,53.98 63.25,55.73 64.25,56.73 v64.25,59.23
SPI1_REG
  Top 0.127: U0-C.21 64.75,61.98 65.75,60.98 | 65.75,60.98 68.93,60.98 U$2.3 | U$3.1 65.75,56.55 65.75,60.98
SPI1_SCK  (via drill 0.25)
  Top 0.127: U$3.8 v62.25,59.23 61.75,59.73 U0-C.15 | U$3.11 61,55.67 v61,55.23
  Route2 0.127: v61,55.23 61,55.48 62.25,56.73 v62.25,59.23
SPI1B_LE  (via drill 0.25)
  Top 0.127: U$3.3 v64.75,58.48 | U$14.10 v59.75,59.73
  Route15 0.127: v59.75,59.73 61.5,57.98 64.25,57.98 v64.75,58.48
SPI1B_MISO  (via drill 0.25, 0.6)
  Top 0.127: U$3.6 v63.25,59.23 | U$10.4 50.6,53.33 51.05,53.78 53.2,53.78 v53.75,53.23 53,52.48 53,48.48 53.88,47.61 U$11.P$6 | U$14.6 56.5,59.17 v56.5,58.48
  Route2 0.127: v63.25,59.23 63.25,56.73 62.49,55.97 62.49,53.74 61.99,53.23 v53.75,53.23
  Route15 0.127: v56.5,58.48 58.25,60.23 62.25,60.23 v63.25,59.23
SPI1B_MOSI  (via drill 0.25, 0.6)
  Top 0.127: U$3.5 v63.75,58.48 | U$7.2 43.75,55.48 44.5,56.23 53,56.23 v53.75,56.98 55,55.73 55,49.48 54.38,48.86 U$11.P$7 | U$14.13 v60.5,61.23
  Route2 0.127: v63.75,58.48 63.75,56.73 62.75,55.73 62.75,53.48 61.75,52.48 53.5,52.48 53,52.98 53,56.23 v53.75,56.98
  Route15 0.127: v60.5,61.23 62.25,61.23 63.75,59.73 v63.75,58.48
SPI1B_SCK  (via drill 0.25, 0.6)
  Top 0.127: v61.75,58.48 U$3.9 | U$8.2 46.25,55.48 46.75,55.98 53.5,55.98 v53.75,55.73 54.75,54.73 54.75,50.48 54.38,50.11 U$11.P$8
  Route2 0.127: v61.75,58.48 61.75,56.73 60.75,55.73 v53.75,55.73
SPI1R_LE
  Top 0.127: U$6.6 65.91,53.33 64.75,54.48 U$3.18
SPI1R_MOSI
  Top 0.127: U$3.16 63.75,53.73 65.42,52.06 U$6.7
SPI1R_SCK  (via drill 0.25, 0.35)
  Top 0.127: U$3.12 61.75,54.73 v61,53.98
  Route2 0.127: 70.92,59.66 U$6.1
  Bottom 0.127: v61,53.98 61.49,53.49 64.74,53.49 64.75,53.48 71.25,53.48 72.25,54.48 72.25,54.66 72.25,54.73 72.25,58.35 U$6.1
  other vias: 70.92,59.68
SPI2_CS0
  Top 0.127: U$6.13 76.64,55.87 78.25,57.48 82.75,57.48 83.25,56.98 83.25,56.48 83,56.23 U$4.13
SPI2_CS1
  Top 0.127: U$6.12 76.61,54.6 78.25,56.23 U$4.2
SPI2_CS2
  Top 0.127: U$6.11 76.59,53.33 78.5,55.23 U$4.4
SPI2_CS3
  Top 0.127: U$6.10 81.83,52.06 83.25,53.48 83.25,53.98 83,54.23 U$4.9
SPI2_LE  (via drill 0.25)
  Top 0.127: U$1.8 v75.75,67.48 | U$1.11 73.19,68.48 v70.5,68.48 67.5,65.48 U0-C.29
  Route2 0.127: v75.75,67.48 74.75,68.48 v70.5,68.48
SPI2_MISO  (via drill 0.25)
  Top 0.127: U$1.5 75.04,65.98 | U$1.5 75,65.98 | U$1.5 v76.5,65.98 | U$1.16 v71.25,65.98 70.25,65.98 68.75,64.48 U0-C.27
  Route2 0.127: v76.5,65.98 v71.25,65.98
SPI2_MOSI  (via drill 0.25)
  Top 0.127: U$1.6 v75.75,66.48 | U$1.13 v70.5,67.48 68,64.98 U0-C.28
  Route2 0.127: v70.5,67.48 73,67.48 74,66.48 v75.75,66.48
SPI2_REG
  Top 0.127: 67.25,63.48 U0-C.25 68,63.48 68.55,62.93 U$2.1 69.45,62.93 70,63.48 71.75,63.48 72.25,63.98 72.25,64.42 U$1.19
SPI2_SCK  (via drill 0.25)
  Top 0.127: U$1.2 v75.75,64.48 | U$1.17 v70.5,65.48 69,63.98 U0-C.26 | U$4.1 81.12,56.8 v80.5,56.8 | U$4.10 83.75,54.73 84,54.98 84,55.48 83.75,55.73 | U$4.12 83.5,55.73 | 83.5,55.73 83.75,55.73 | U$4.5 v78.75,54.73 | 83.75,55.98 v83.75,56.23 | 83.75,55.98 83.62,55.86 | 83.62,55.86 83.5,55.73 | 83.75,55.73 83.75,55.98 | 83.75,55.73 83.62,55.86
  Route2 0.127: v70.5,65.48 74.75,65.48 v75.75,64.48 75.75,61.55 v80.5,56.8 | v83.75,56.23 81.06,56.23 v80.5,56.8 | v78.75,54.73 78.75,55.98 79,56.23 79.94,56.23 v80.5,56.8
SPI2_SCK0  (via drill 0.25)
  Top 0.127: U$4.11 v83.5,55.23
SPI2_SCK1  (via drill 0.25)
  Top 0.127: U$4.3 v79.5,55.73
SPI2_SCK2  (via drill 0.25)
  Top 0.127: U$4.6 v79.5,54.23
SPI2_SCK3  (via drill 0.25)
  Top 0.127: U$4.8 81.88,53.67 v82.5,53.67
SPI2B_LE  (via drill 0.25)
  Top 0.127: U$1.12 72.31,67.97 v71.25,67.97
SPI2B_MISO  (via drill 0.25)
  Top 0.127: U$1.15 v70.5,66.48
SPI2B_MOSI  (via drill 0.25)
  Top 0.127: U$1.14 v71.25,66.98
SPI2B_SCK  (via drill 0.25)
  Top 0.127: 72,64.98 U$1.18 v71.25,64.98
SPI2R_LE
  Top 0.127: U$1.9 76.5,67.98 77.5,66.98 77.5,57.98 76.66,57.14 U$6.14
SPI2R_MOSI
  Top 0.127: U$1.7 74.69,66.97 76.51,66.97 77.25,66.23 77.25,58.94 76.72,58.41 U$6.15
SPI2R_SCK  (via drill 0.25)
  Top 0.127: U$1.3 75.25,64.98 v75.75,65.48 76.25,64.98 76.25,64.23 75,62.98 75,51.23 75.44,50.79 U$6.9
ST
  Top 0.127: U$14.11 60,60.23 60.25,59.98 60.25,49.48 59.63,48.87 U$12.4
STATUS
  Top 0.127: U$12.6 55.77,46.33 55.25,46.84 55.25,46.98 55.25,47.23 55.25,58.98 56,59.73 U$14.5
SWDIO
  Top 0.127: U0-C.34 67.5,67.98 68.5,68.98 68.5,69.23 69.5,70.23
U0-S_SW  (via drill 0.35)
  Top 0.127: U$5.1 40.73,51.85 U0-S.5
  other vias: 39.5,53.08
U0-S_VOUT
  Top 0.127: R2.1 56.95,47.6 U$12.5
U1-S_REGOUT
  Top 0.127: U1-S.10 46.45,45.58 C5.1
USART1_RX
  Top 0.127: U0-C.31 67.5,66.48 69.62,68.61 69.62,68.73 69.62,68.86 70.25,69.48
USART1_TX
  Top 0.127: U0-C.30 67.5,65.98 70,68.48 70,68.73 70.5,69.23
VCAP_1  (via drill 0.25)
  Top 0.127: U0-C.22 65.25,62.2 v65.74,61.72
  Route2 0.127: C1.1 65.74,61.7 v65.74,61.72
  other vias: 68,59.43
VDDA
  Top 0.127: U0-C.9 57.9,64.98 FB1.1